# EAGLE design keyswitch (EAGLE 8.1.1)
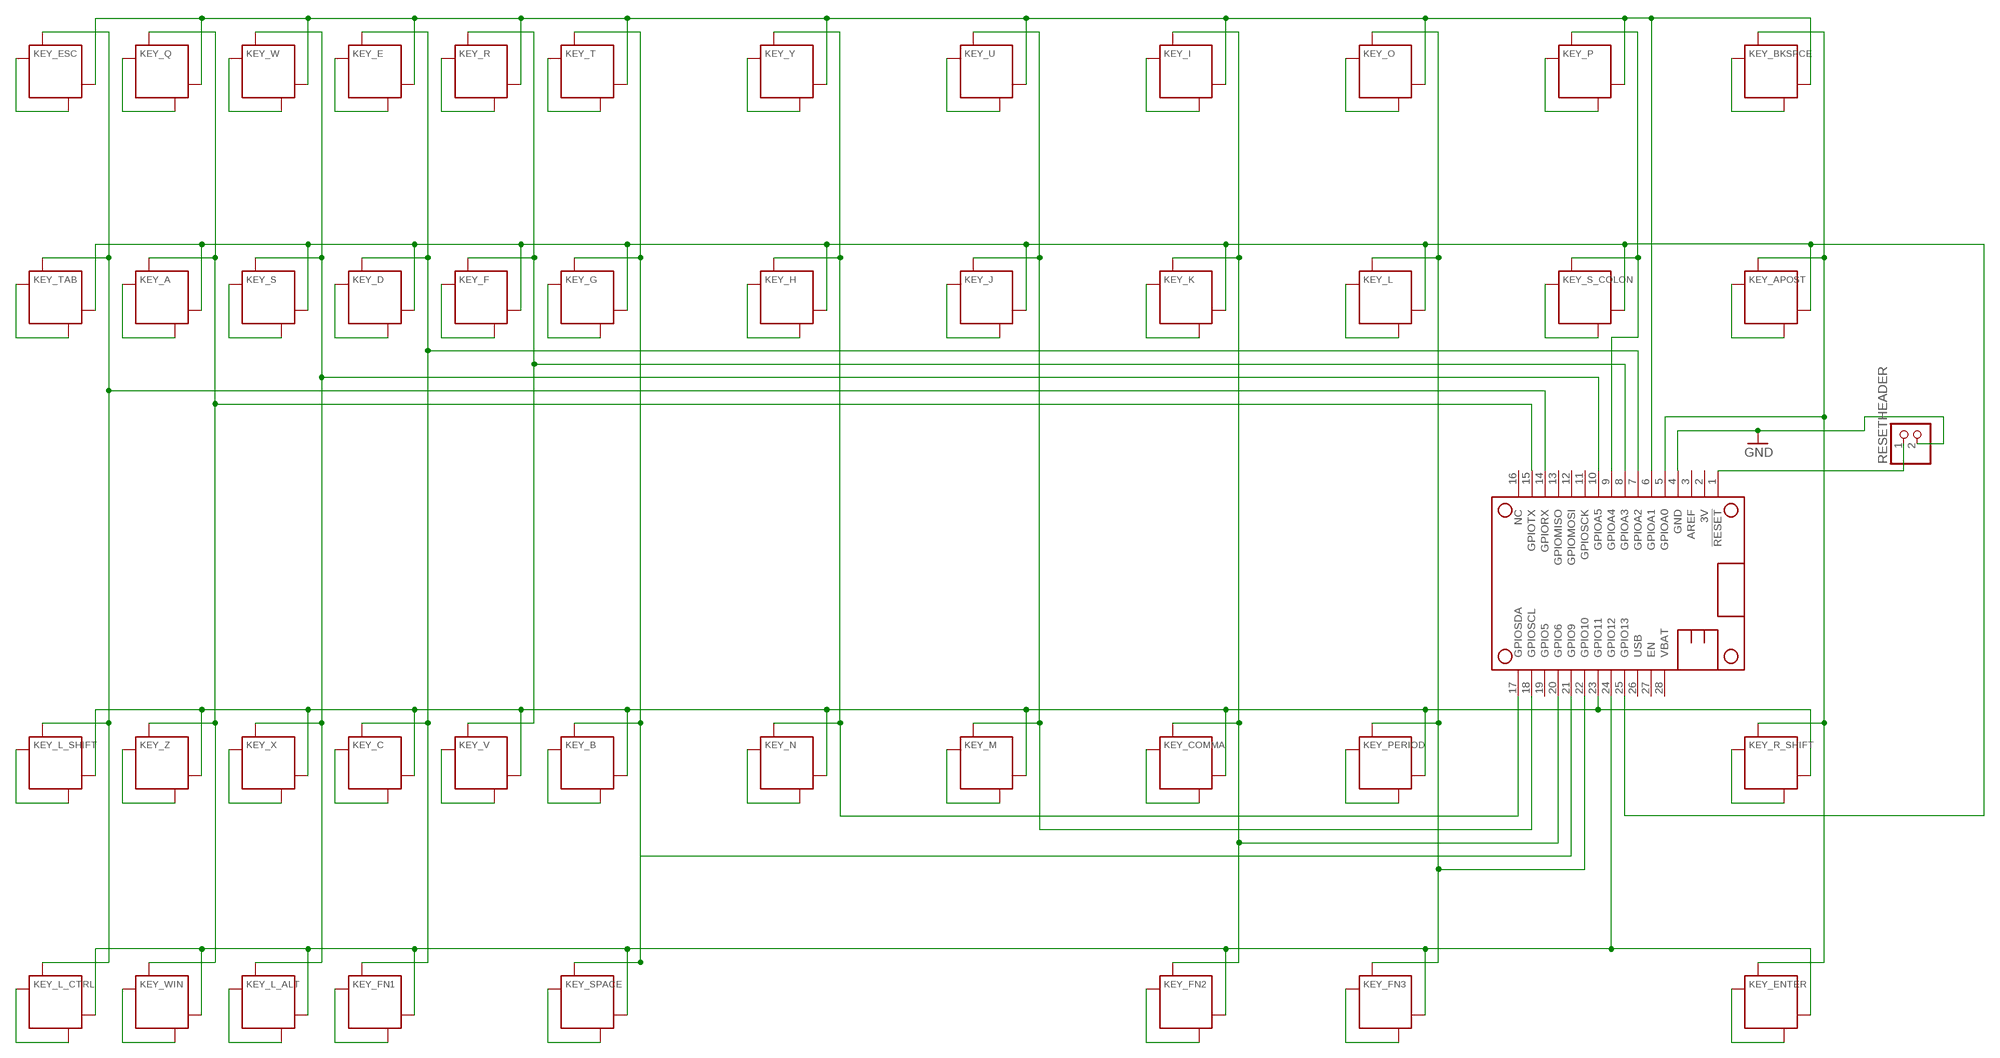
[diagram p0: schematic, sheet 1]

## Parts
FEATHER  FEATHERWING_NODIM  [FEATHERWING_DIM]
KEY_A  KEYSWITCH-DIODE-MX-1U-DIODE  [MX-1U-DIODE]
KEY_APOST  KEYSWITCH-DIODE-MX-1U-DIODE  [MX-1U-DIODE]
KEY_B  KEYSWITCH-DIODE-MX-1U-DIODE  [MX-1U-DIODE]
KEY_BKSPCE  KEYSWITCH-DIODE-MX-1U-DIODE  [MX-1U-DIODE]
KEY_C  KEYSWITCH-DIODE-MX-1U-DIODE  [MX-1U-DIODE]
KEY_COMMA  KEYSWITCH-DIODE-MX-1U-DIODE  [MX-1U-DIODE]
KEY_D  KEYSWITCH-DIODE-MX-1U-DIODE  [MX-1U-DIODE]
KEY_E  KEYSWITCH-DIODE-MX-1U-DIODE  [MX-1U-DIODE]
KEY_ENTER  KEYSWITCH-DIODE-MX-1U-DIODE  [MX-1U-DIODE]
KEY_ESC  KEYSWITCH-DIODE-MX-1U-DIODE  [MX-1U-DIODE]
KEY_F  KEYSWITCH-DIODE-MX-1U-DIODE  [MX-1U-DIODE]
KEY_FN1  KEYSWITCH-DIODE-MX-1U-DIODE  [MX-1U-DIODE]
KEY_FN2  KEYSWITCH-DIODE-MX-1U-DIODE  [MX-1U-DIODE]
KEY_FN3  KEYSWITCH-DIODE-MX-1U-DIODE  [MX-1U-DIODE]
KEY_G  KEYSWITCH-DIODE-MX-1U-DIODE  [MX-1U-DIODE]
KEY_H  KEYSWITCH-DIODE-MX-1U-DIODE  [MX-1U-DIODE]
KEY_I  KEYSWITCH-DIODE-MX-1U-DIODE  [MX-1U-DIODE]
KEY_J  KEYSWITCH-DIODE-MX-1U-DIODE  [MX-1U-DIODE]
KEY_K  KEYSWITCH-DIODE-MX-1U-DIODE  [MX-1U-DIODE]
KEY_L  KEYSWITCH-DIODE-MX-1U-DIODE  [MX-1U-DIODE]
KEY_L_ALT  KEYSWITCH-DIODE-MX-1U-DIODE  [MX-1U-DIODE]
KEY_L_CTRL  KEYSWITCH-DIODE-MX-1U-DIODE  [MX-1U-DIODE]
KEY_L_SHIFT  KEYSWITCH-DIODE-MX-1U-DIODE  [MX-1U-DIODE]
KEY_M  KEYSWITCH-DIODE-MX-1U-DIODE  [MX-1U-DIODE]
KEY_N  KEYSWITCH-DIODE-MX-1U-DIODE  [MX-1U-DIODE]
KEY_O  KEYSWITCH-DIODE-MX-1U-DIODE  [MX-1U-DIODE]
KEY_P  KEYSWITCH-DIODE-MX-1U-DIODE  [MX-1U-DIODE]
KEY_PERIOD  KEYSWITCH-DIODE-MX-1U-DIODE  [MX-1U-DIODE]
KEY_Q  KEYSWITCH-DIODE-MX-1U-DIODE  [MX-1U-DIODE]
KEY_R  KEYSWITCH-DIODE-MX-1U-DIODE  [MX-1U-DIODE]
KEY_R_SHIFT  KEYSWITCH-DIODE-MX-1U-DIODE  [MX-1U-DIODE]
KEY_S  KEYSWITCH-DIODE-MX-1U-DIODE  [MX-1U-DIODE]
KEY_S_COLON  KEYSWITCH-DIODE-MX-1U-DIODE  [MX-1U-DIODE]
KEY_SPACE  KEYSWITCH-DIODE-MX-1U-DIODE  [MX-1U-DIODE]
KEY_T  KEYSWITCH-DIODE-MX-1U-DIODE  [MX-1U-DIODE]
KEY_TAB  KEYSWITCH-DIODE-MX-1U-DIODE  [MX-1U-DIODE]
KEY_U  KEYSWITCH-DIODE-MX-1U-DIODE  [MX-1U-DIODE]
KEY_V  KEYSWITCH-DIODE-MX-1U-DIODE  [MX-1U-DIODE]
KEY_W  KEYSWITCH-DIODE-MX-1U-DIODE  [MX-1U-DIODE]
KEY_WIN  KEYSWITCH-DIODE-MX-1U-DIODE  [MX-1U-DIODE]
KEY_X  KEYSWITCH-DIODE-MX-1U-DIODE  [MX-1U-DIODE]
KEY_Y  KEYSWITCH-DIODE-MX-1U-DIODE  [MX-1U-DIODE]
KEY_Z  KEYSWITCH-DIODE-MX-1U-DIODE  [MX-1U-DIODE]
RESETHEADER  PINHD-1X2  [1X02]

## Nets
GND: FEATHER.4(GND) RESETHEADER.2
N$1: KEY_ESC.D+ KEY_ESC.MX1(P0)
N$2: KEY_Q.D+ KEY_Q.MX1(P0)
N$3: KEY_W.D+ KEY_W.MX1(P0)
N$4: KEY_E.D+ KEY_E.MX1(P0)
N$5: KEY_R.D+ KEY_R.MX1(P0)
N$6: KEY_T.D+ KEY_T.MX1(P0)
N$7: KEY_Y.D+ KEY_Y.MX1(P0)
N$8: KEY_U.D+ KEY_U.MX1(P0)
N$9: KEY_I.D+ KEY_I.MX1(P0)
N$10: KEY_O.D+ KEY_O.MX1(P0)
N$11: KEY_P.D+ KEY_P.MX1(P0)
N$12: KEY_BKSPCE.D+ KEY_BKSPCE.MX1(P0)
N$13: KEY_TAB.D+ KEY_TAB.MX1(P0)
N$14: KEY_A.D+ KEY_A.MX1(P0)
N$15: KEY_S.D+ KEY_S.MX1(P0)
N$16: KEY_D.D+ KEY_D.MX1(P0)
N$17: KEY_F.D+ KEY_F.MX1(P0)
N$18: KEY_G.D+ KEY_G.MX1(P0)
N$19: KEY_H.D+ KEY_H.MX1(P0)
N$20: KEY_J.D+ KEY_J.MX1(P0)
N$21: KEY_K.D+ KEY_K.MX1(P0)
N$22: KEY_L.D+ KEY_L.MX1(P0)
N$23: KEY_S_COLON.D+ KEY_S_COLON.MX1(P0)
N$24: KEY_APOST.D+ KEY_APOST.MX1(P0)
N$25: KEY_L_SHIFT.D+ KEY_L_SHIFT.MX1(P0)
N$26: KEY_Z.D+ KEY_Z.MX1(P0)
N$27: KEY_X.D+ KEY_X.MX1(P0)
N$28: KEY_C.D+ KEY_C.MX1(P0)
N$29: KEY_V.D+ KEY_V.MX1(P0)
N$30: KEY_B.D+ KEY_B.MX1(P0)
N$31: KEY_N.D+ KEY_N.MX1(P0)
N$32: KEY_M.D+ KEY_M.MX1(P0)
N$33: KEY_COMMA.D+ KEY_COMMA.MX1(P0)
N$34: KEY_PERIOD.D+ KEY_PERIOD.MX1(P0)
N$35: FEATHER.7(GPIOA2) KEY_C.MX2(P1) KEY_D.MX2(P1) KEY_E.MX2(P1) KEY_FN1.MX2(P1)
N$36: KEY_R_SHIFT.D+ KEY_R_SHIFT.MX1(P0)
N$37: KEY_WIN.D+ KEY_WIN.MX1(P0)
N$38: KEY_L_ALT.D+ KEY_L_ALT.MX1(P0)
N$39: KEY_FN1.D+ KEY_FN1.MX1(P0)
N$40: FEATHER.1(!RESET) RESETHEADER.1
N$41: KEY_SPACE.D+ KEY_SPACE.MX1(P0)
N$42: FEATHER.15(GPIOTX) KEY_A.MX2(P1) KEY_Q.MX2(P1) KEY_WIN.MX2(P1) KEY_Z.MX2(P1)
N$43: FEATHER.10(GPIOA5) KEY_L_ALT.MX2(P1) KEY_S.MX2(P1) KEY_W.MX2(P1) KEY_X.MX2(P1)
N$44: KEY_FN2.D+ KEY_FN2.MX1(P0)
N$45: KEY_FN3.D+ KEY_FN3.MX1(P0)
N$46: FEATHER.21(GPIO9) KEY_B.MX2(P1) KEY_G.MX2(P1) KEY_SPACE.MX2(P1) KEY_T.MX2(P1)
N$47: KEY_ENTER.D+ KEY_ENTER.MX1(P0)
N$49: FEATHER.8(GPIOA3) KEY_F.MX2(P1) KEY_R.MX2(P1) KEY_V.MX2(P1)
N$50: FEATHER.24(GPIO12) KEY_ENTER.D- KEY_FN1.D- KEY_FN2.D- KEY_FN3.D- KEY_L_ALT.D- KEY_L_CTRL.D- KEY_SPACE.D- KEY_WIN.D-
N$51: FEATHER.17(GPIOSDA) KEY_H.MX2(P1) KEY_N.MX2(P1) KEY_Y.MX2(P1)
N$52: FEATHER.22(GPIO10) KEY_FN3.MX2(P1) KEY_L.MX2(P1) KEY_O.MX2(P1) KEY_PERIOD.MX2(P1)
N$53: FEATHER.20(GPIO6) KEY_COMMA.MX2(P1) KEY_FN2.MX2(P1) KEY_I.MX2(P1) KEY_K.MX2(P1)
N$54: FEATHER.18(GPIOSCL) KEY_J.MX2(P1) KEY_M.MX2(P1) KEY_U.MX2(P1)
N$55: FEATHER.9(GPIOA4) KEY_P.MX2(P1) KEY_S_COLON.MX2(P1)
N$56: FEATHER.5(GPIOA0) KEY_APOST.MX2(P1) KEY_BKSPCE.MX2(P1) KEY_ENTER.MX2(P1) KEY_R_SHIFT.MX2(P1)
N$57: FEATHER.6(GPIOA1) KEY_BKSPCE.D- KEY_E.D- KEY_ESC.D- KEY_I.D- KEY_O.D- KEY_P.D- KEY_Q.D- KEY_R.D- KEY_T.D- KEY_U.D- KEY_W.D- KEY_Y.D-
N$58: FEATHER.14(GPIORX) KEY_ESC.MX2(P1) KEY_L_CTRL.MX2(P1) KEY_L_SHIFT.MX2(P1) KEY_TAB.MX2(P1)
N$59: FEATHER.23(GPIO11) KEY_B.D- KEY_C.D- KEY_COMMA.D- KEY_L_SHIFT.D- KEY_M.D- KEY_N.D- KEY_PERIOD.D- KEY_R_SHIFT.D- KEY_V.D- KEY_X.D- KEY_Z.D-
N$60: KEY_L_CTRL.D+ KEY_L_CTRL.MX1(P0)
N$72: FEATHER.25(GPIO13) KEY_A.D- KEY_APOST.D- KEY_D.D- KEY_F.D- KEY_G.D- KEY_H.D- KEY_J.D- KEY_K.D- KEY_L.D- KEY_S.D- KEY_S_COLON.D- KEY_TAB.D-
Unconnected: FEATHER.2(3V) FEATHER.3(AREF) FEATHER.11(GPIOSCK) FEATHER.12(GPIOMOSI) FEATHER.13(GPIOMISO) FEATHER.16(NC) FEATHER.19(GPIO5) FEATHER.26(USB) FEATHER.27(EN) FEATHER.28(VBAT)

## Library data of the parts
FEATHER = adafruit:FEATHERWING
KEY_A KEY_APOST KEY_B KEY_BKSPCE KEY_C KEY_COMMA KEY_D KEY_E KEY_ENTER KEY_ESC KEY_F KEY_FN1-KEY_FN3 KEY_G KEY_H KEY_I KEY_J KEY_K KEY_L KEY_L_ALT KEY_L_CTRL KEY_L_SHIFT KEY_M KEY_N KEY_O KEY_P KEY_PERIOD KEY_Q KEY_R KEY_R_SHIFT KEY_S KEY_S_COLON KEY_SPACE KEY_T KEY_TAB KEY_U KEY_V KEY_W KEY_WIN KEY_X KEY_Y KEY_Z = Keyboard:KEYSWITCH-DIODE
RESETHEADER = pinhead:PINHD-1X2: PIN HEADER

## Net classes
0 default: clearance 0.205 mm

## Board
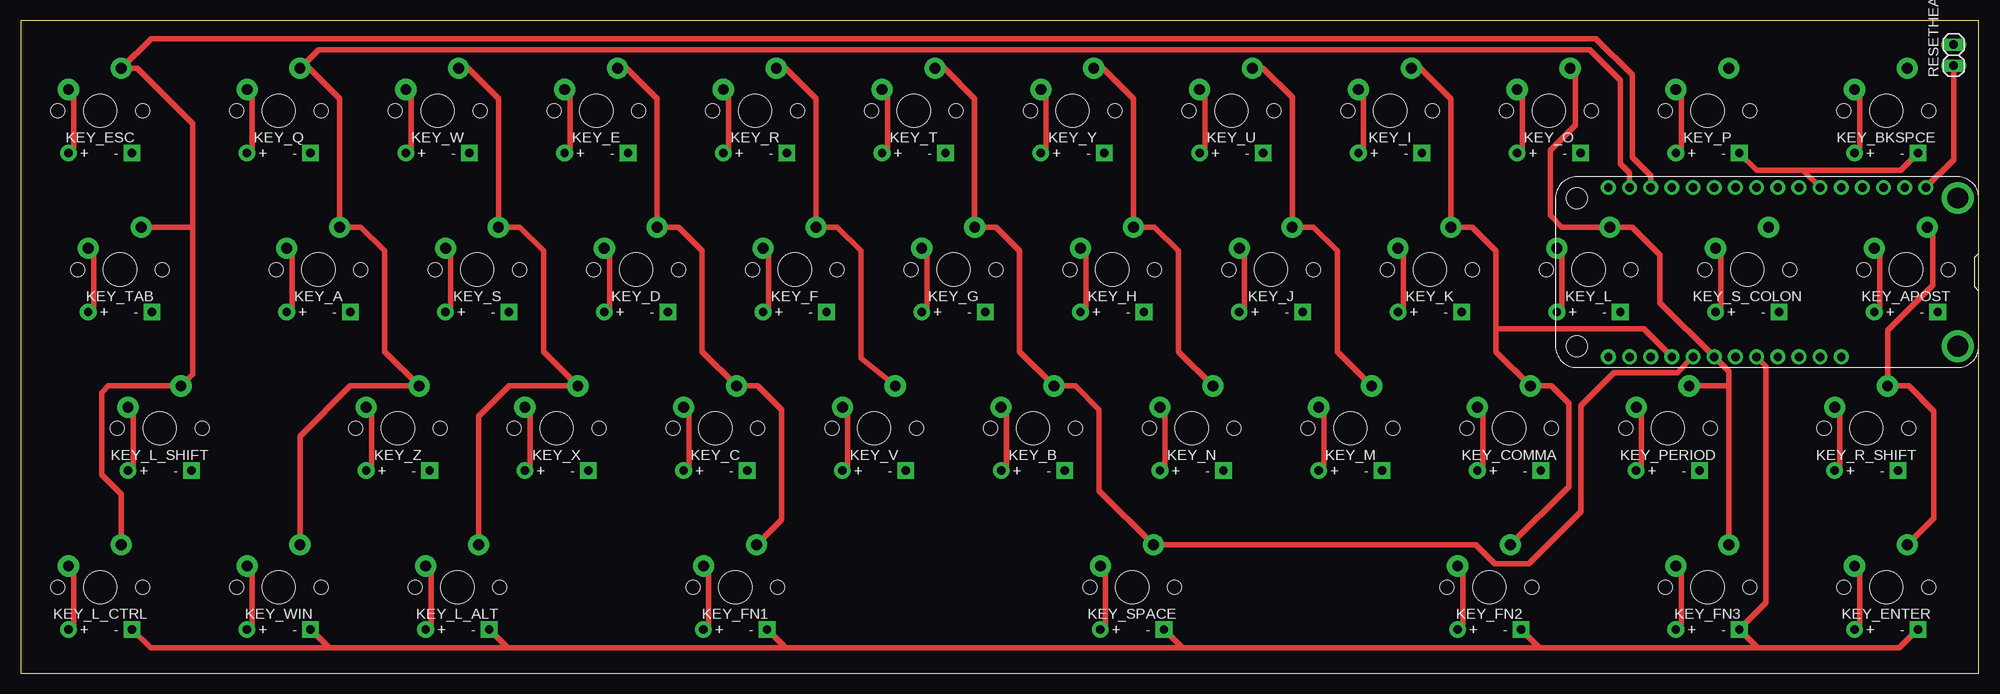
[diagram p1: board, top side]
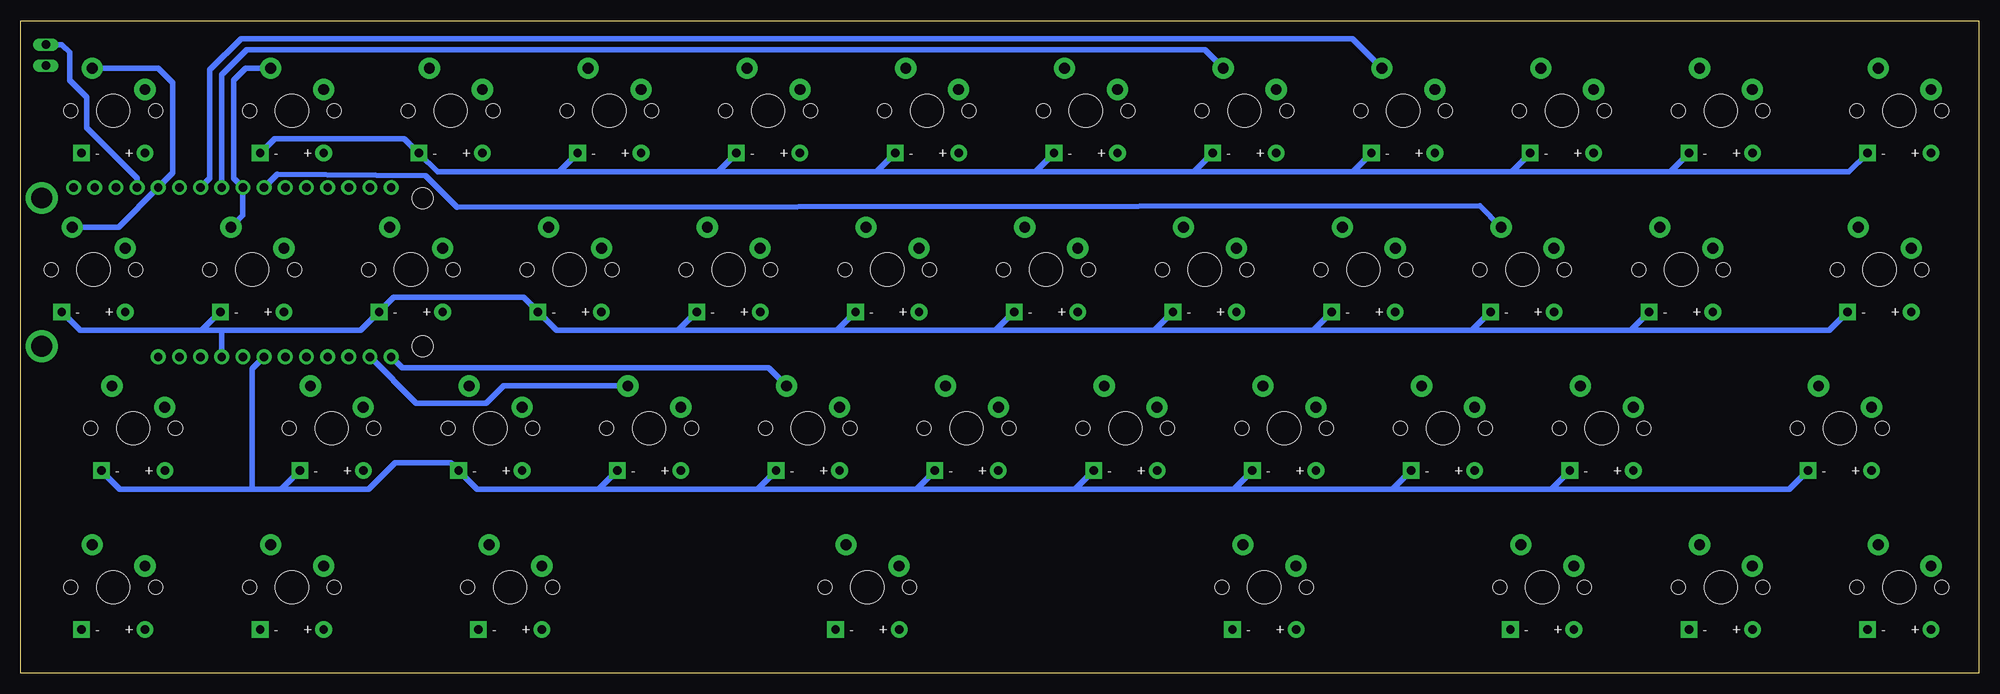
[diagram p2: board, bottom side, seen from below]

Size 234.93 x 78.25 mm. Coordinates in mm from the lower left corner, seen from the top.
Outline: 0,0 234.93,0 234.93,78.25 0,78.25 0,0
Copper layers (1*16): Top 0.035mm / dielectric 1.5mm / Bottom 0.035mm
Design rules "keyswitch *": minimum track width 10mil, minimum drill 20mil, track to track 10mil, track to pad 10mil, pad to pad 10mil, via to via 10mil, smd to smd 10mil, copper to edge 20mil, drill to drill 8mil, minimum pad ring 10mil, minimum via ring 8mil, stop-mask expansion 4mil, vias tented up to drill 0mil, thermal gap 10mil

### Footprints (pad centres in the part's own frame; a part is rotated, then mirrored left to right if it is on the bottom)
FEATHERWING_DIM = drill 1 pad 1.778: 1 6.35,1.27; 2 8.89,1.27; 3 11.43,1.27; 4 13.97,1.27; 5 16.51,1.27; 6 19.05,1.27; 7 21.59,1.27; 8 24.13,1.27; 9 26.67,1.27; 10 29.21,1.27; 11 31.75,1.27; 12 34.29,1.27; 13 36.83,1.27; 14 39.37,1.27; 15 41.91,1.27; 16 44.45,1.27; 17 44.45,21.59; 18 41.91,21.59; 19 39.37,21.59; 20 36.83,21.59; 21 34.29,21.59; 22 31.75,21.59; 23 29.21,21.59; 24 26.67,21.59; 25 24.13,21.59; 26 21.59,21.59; 27 19.05,21.59; 28 16.51,21.59 | drill 2.5 pad 3.81: P$1 2.54,20.32; P$2 2.54,2.54 | hole 2.54: 48.26,20.32; 48.26,2.54
MX-1U-DIODE = drill 1 pad 2: D+ -3.81,-5.08 | drill 1 pad 2 square: D- 3.81,-5.08 | drill 1.3 pad 2.54: MX1 -3.81,2.54; MX2 2.54,5.08 | hole 4: 0,0 | hole 1.7: -5.08,0; 5.08,0
1X02 = drill 1.016 long: 1 -1.27,0; 2 1.27,0

### Placement (x,y rotation side)
FEATHER  234.95,59.53 180 top
KEY_A  35.72,48.42 0 top
KEY_APOST  226.22,48.42 0 top
KEY_B  121.44,29.37 0 top
KEY_BKSPCE  223.84,67.47 0 top
KEY_C  83.34,29.37 0 top
KEY_COMMA  178.59,29.37 0 top
KEY_D  73.82,48.42 0 top
KEY_E  69.06,67.47 0 top
KEY_ENTER  223.84,10.32 0 top
KEY_ESC  9.53,67.47 0 top
KEY_F  92.87,48.42 0 top
KEY_FN1  85.73,10.32 0 top
KEY_FN2  176.21,10.32 0 top
KEY_FN3  202.41,10.32 0 top
KEY_G  111.92,48.42 0 top
KEY_H  130.97,48.42 0 top
KEY_I  164.31,67.47 0 top
KEY_J  150.02,48.42 0 top
KEY_K  169.07,48.42 0 top
KEY_L  188.12,48.42 0 top
KEY_L_ALT  52.39,10.32 0 top
KEY_L_CTRL  9.53,10.32 0 top
KEY_L_SHIFT  16.67,29.37 0 top
KEY_M  159.54,29.37 0 top
KEY_N  140.49,29.37 0 top
KEY_O  183.36,67.47 0 top
KEY_P  202.41,67.47 0 top
KEY_PERIOD  197.64,29.37 0 top
KEY_Q  30.96,67.47 0 top
KEY_R  88.11,67.47 0 top
KEY_R_SHIFT  221.46,29.37 0 top
KEY_S  54.77,48.42 0 top
KEY_S_COLON  207.17,48.42 0 top
KEY_SPACE  133.35,10.32 0 top
KEY_T  107.16,67.47 0 top
KEY_TAB  11.91,48.42 0 top
KEY_U  145.26,67.47 0 top
KEY_V  102.39,29.37 0 top
KEY_W  50.01,67.47 0 top
KEY_WIN  30.96,10.32 0 top
KEY_X  64.29,29.37 0 top
KEY_Y  126.21,67.47 0 top
KEY_Z  45.24,29.37 0 top
RESETHEADER  231.93,74.14 90 top

### Tracks (layer width: path | path; a pad name or v marks a point on that pad's centre or on a via)
GND
  Bottom 0.635: FEATHER.4 220.98,59.37 227.01,65.4 227.01,69.06 229.08,71.12 229.08,74.45 230.03,75.41 RESETHEADER.2
N$1
  Top 0.635: KEY_ESC.MX1 6.35,69.37 6.35,63.02 KEY_ESC.D+
N$2
  Top 0.635: KEY_Q.MX1 27.78,69.37 27.78,63.02 KEY_Q.D+
N$3
  Top 0.635: KEY_W.MX1 46.83,69.37 46.83,63.02 KEY_W.D+
N$4
  Top 0.635: KEY_E.MX1 65.88,69.37 65.88,63.02 KEY_E.D+
N$5
  Top 0.635: KEY_R.MX1 84.93,69.37 84.93,63.02 KEY_R.D+
N$6
  Top 0.635: KEY_T.MX1 103.98,69.37 103.98,63.02 KEY_T.D+
N$7
  Top 0.635: KEY_Y.MX1 123.03,69.37 123.03,63.02 KEY_Y.D+
N$8
  Top 0.635: KEY_U.MX1 142.08,69.37 142.08,63.02 KEY_U.D+
N$9
  Top 0.635: KEY_I.MX1 161.13,69.37 161.13,63.02 KEY_I.D+
N$10
  Top 0.635: KEY_O.MX1 180.18,69.37 180.18,63.02 KEY_O.D+
N$11
  Top 0.635: KEY_P.MX1 199.23,69.37 199.23,63.02 KEY_P.D+
N$12
  Top 0.635: KEY_BKSPCE.MX1 220.66,69.37 220.66,63.02 KEY_BKSPCE.D+
N$13
  Top 0.635: KEY_TAB.MX1 8.73,50.32 8.73,43.97 KEY_TAB.D+
N$14
  Top 0.635: KEY_A.MX1 32.54,50.32 32.54,43.97 KEY_A.D+
N$15
  Top 0.635: KEY_S.MX1 51.59,50.32 51.59,43.97 KEY_S.D+
N$16
  Top 0.635: KEY_D.MX1 70.64,50.32 70.64,43.97 KEY_D.D+
N$17
  Top 0.635: KEY_F.MX1 89.69,50.32 89.69,43.97 KEY_F.D+
N$18
  Top 0.635: KEY_G.MX1 108.74,50.32 108.74,43.97 KEY_G.D+
N$19
  Top 0.635: KEY_H.MX1 127.79,50.32 127.79,43.97 KEY_H.D+
N$20
  Top 0.635: KEY_J.MX1 146.84,50.32 146.84,43.97 KEY_J.D+
N$21
  Top 0.635: KEY_K.MX1 165.89,50.32 165.89,43.97 KEY_K.D+
N$22
  Top 0.635: KEY_L.MX1 184.94,50.32 184.94,43.97 KEY_L.D+
N$23
  Top 0.635: KEY_S_COLON.MX1 203.99,50.32 203.99,43.97 KEY_S_COLON.D+
N$24
  Top 0.635: KEY_APOST.MX1 223.04,50.32 223.04,43.97 KEY_APOST.D+
N$25
  Top 0.635: KEY_L_SHIFT.MX1 13.49,31.27 13.49,24.92 KEY_L_SHIFT.D+
N$26
  Top 0.635: KEY_Z.MX1 42.07,31.27 42.07,24.92 KEY_Z.D+
N$27
  Top 0.635: KEY_X.MX1 61.12,31.27 61.12,24.92 KEY_X.D+
N$28
  Top 0.635: KEY_C.MX1 80.17,31.27 80.17,24.92 KEY_C.D+
N$29
  Top 0.635: KEY_V.MX1 99.22,31.27 99.22,24.92 KEY_V.D+
N$30
  Top 0.635: KEY_B.MX1 118.27,31.27 118.27,24.92 KEY_B.D+
N$31
  Top 0.635: KEY_N.MX1 137.32,31.27 137.32,24.92 KEY_N.D+
N$32
  Top 0.635: KEY_M.MX1 156.37,31.27 156.37,24.92 KEY_M.D+
N$33
  Top 0.635: KEY_COMMA.MX1 175.42,31.27 175.42,24.92 KEY_COMMA.D+
N$34
  Top 0.635: KEY_PERIOD.MX1 194.47,31.27 194.47,24.92 KEY_PERIOD.D+
N$35
  Top 0.635: KEY_E.MX2 72.71,72.55 76.36,68.9 KEY_D.MX2 78.9,53.5 81.76,50.64 81.76,38.58 KEY_C.MX2 88.42,34.45 91.28,31.59 91.28,18.41 KEY_FN1.MX2
  Bottom 0.635: KEY_E.MX2 75.17,76.12 208.52,76.12 212.25,72.39 212.25,59.37 FEATHER.7
N$36
  Top 0.635: KEY_R_SHIFT.MX1 218.28,31.27 218.28,24.92 KEY_R_SHIFT.D+
N$37
  Top 0.635: KEY_WIN.MX1 27.78,12.22 27.78,5.87 KEY_WIN.D+
N$38
  Top 0.635: KEY_L_ALT.MX1 49.21,12.22 49.21,5.87 KEY_L_ALT.D+
N$39
  Top 0.635: KEY_FN1.MX1 82.55,12.22 82.55,5.87 KEY_FN1.D+
N$40
  Top 0.635: FEATHER.1 231.93,61.59 RESETHEADER.1
N$41
  Top 0.635: KEY_SPACE.MX1 130.18,12.22 130.18,5.87 KEY_SPACE.D+
N$42
  Top 0.635: KEY_WIN.MX2 33.5,28.42 39.53,34.45 KEY_Z.MX2 43.66,38.58 43.66,50.64 40.8,53.5 KEY_A.MX2 38.26,68.9 34.61,72.55 KEY_Q.MX2 35.72,74.77 188.28,74.77 191.93,71.12 191.93,61.12 193.04,60.01 FEATHER.15
N$43
  Top 0.635: KEY_W.MX2 53.66,72.55 57.31,68.9 KEY_S.MX2 59.85,53.5 62.71,50.64 62.71,38.58 KEY_X.MX2 58.58,34.45 54.93,30.8 KEY_L_ALT.MX2
  Bottom 0.635: FEATHER.10 204.15,59.85 186.37,59.69 182.56,55.88 59.85,56.04 KEY_S.MX2
N$44
  Top 0.635: KEY_FN2.MX1 173.04,12.22 173.04,5.87 KEY_FN2.D+
N$45
  Top 0.635: KEY_FN3.MX1 199.23,12.22 199.23,5.87 KEY_FN3.D+
N$46
  Top 0.635: KEY_T.MX2 110.81,72.55 114.46,68.9 KEY_G.MX2 117,53.5 119.86,50.64 119.86,38.58 KEY_B.MX2 126.52,34.45 129.38,31.59 129.38,21.91 KEY_SPACE.MX2 174.62,15.4 176.88,13.14 180.94,13.14 187.17,19.37 187.17,32.07 191.14,36.04 198.75,36.04 FEATHER.21
N$47
  Top 0.635: KEY_ENTER.MX1 220.66,12.22 220.66,5.87 KEY_ENTER.D+
N$49
  Top 0.635: KEY_R.MX2 91.76,72.55 95.41,68.9 KEY_F.MX2 97.95,53.5 100.81,50.64 100.81,37.78 KEY_V.MX2
  Bottom 0.635: KEY_R.MX2 92.87,74.77 207.8,74.77 210.82,71.75 FEATHER.8
N$50
  Top 0.635: KEY_L_CTRL.D- 15.56,3.02 36.99,3.02 | 36.99,3.02 KEY_WIN.D- | 36.99,3.02 58.42,3.02 | 58.42,3.02 KEY_L_ALT.D- | 58.42,3.02 91.76,3.02 | KEY_FN1.D- 91.76,3.02 | 91.76,3.02 139.38,3.02 | KEY_SPACE.D- 139.38,3.02 | 139.38,3.02 182.25,3.02 | 182.25,3.02 KEY_FN2.D- | 182.25,3.02 208.44,3.02 | 208.44,3.02 KEY_FN3.D- 209.39,8.41 209.39,36.83 FEATHER.24 | KEY_ENTER.D- 225.43,3.02 208.44,3.02
N$51
  Top 0.635: KEY_Y.MX2 129.86,72.55 133.51,68.9 KEY_H.MX2 136.05,53.5 138.91,50.64 138.91,38.58 KEY_N.MX2
  Bottom 0.635: KEY_N.MX2 145.19,36.61 189.17,36.61 FEATHER.17
N$52
  Top 0.635: KEY_O.MX2 186.53,71.91 186.53,65.72 183.52,62.71 183.52,54.93 184.94,53.5 KEY_L.MX2 193.36,53.5 196.69,50.16 196.69,44.45 FEATHER.22 204.95,36.19 204.95,34.29 | 204.95,34.29 KEY_FN3.MX2 | KEY_PERIOD.MX2 204.95,34.45 204.95,34.29
N$53
  Top 0.635: KEY_I.MX2 167.96,72.55 171.61,68.9 KEY_K.MX2 174.15,53.5 177.01,50.64 177.01,41.31 | 177.01,41.31 177.01,38.58 KEY_COMMA.MX2 183.67,34.45 185.74,32.38 185.74,22.38 KEY_FN2.MX2 | 177.01,41.31 194.75,41.31 FEATHER.20
N$54
  Top 0.635: KEY_U.MX2 149.07,72.55 152.56,69.06 KEY_J.MX2 155.1,53.5 157.96,50.64 157.96,38.58 KEY_M.MX2
  Bottom 0.635: KEY_M.MX2 177.01,34.45 179.07,32.38 187.48,32.38 FEATHER.18
N$55
  Bottom 0.635: KEY_P.MX2 207.96,72.55 209.39,71.12 209.39,59.37 FEATHER.9 208.28,54.93 KEY_S_COLON.MX2
N$56
  Top 0.635: KEY_ENTER.MX2 229.55,18.57 229.55,31.43 226.54,34.45 KEY_R_SHIFT.MX2 224,41.12 229.39,46.51 229.39,52.86 KEY_APOST.MX2
  Bottom 0.635: KEY_APOST.MX2 223.2,53.5 FEATHER.5 216.69,60.01 216.69,70.8 218.44,72.55 KEY_BKSPCE.MX2
N$57
  Top 0.635: KEY_P.D- 208.28,60.32 213.84,60.32 | 213.84,60.32 225.58,60.32 KEY_BKSPCE.D- | FEATHER.6 213.84,60.32
  Bottom 0.635: KEY_ESC.D- 15.56,60.17 36.99,60.17 | 36.99,60.17 KEY_Q.D- | 36.99,60.17 56.04,60.17 | KEY_W.D- 56.04,60.17 | 56.04,60.17 75.09,60.17 | 75.09,60.17 KEY_E.D- | 75.09,60.17 94.14,60.17 | 94.14,60.17 KEY_R.D- | 94.14,60.17 113.19,60.17 | 113.19,60.17 KEY_T.D- | 113.19,60.17 132.24,60.17 | 132.24,60.17 KEY_Y.D- | 132.24,60.17 151.29,60.17 | KEY_U.D- 151.29,60.17 | 151.29,60.17 170.34,60.17 | KEY_I.D- 170.34,60.17 | 170.34,60.17 184.94,60.17 KEY_O.D- 188.91,64.14 204.47,64.14 KEY_P.D-
N$58
  Top 0.635: KEY_L_CTRL.MX2 12.07,21.43 9.68,23.81 9.68,33.65 10.48,34.45 KEY_L_SHIFT.MX2 20.64,35.88 20.64,53.5 | 20.64,53.5 20.64,65.88 13.97,72.55 KEY_ESC.MX2 15.64,76.12 188.99,76.12 193.36,71.75 193.36,61.91 195.58,59.69 FEATHER.14 | KEY_TAB.MX2 20.64,53.5
N$59
  Bottom 0.635: KEY_L_SHIFT.D- 22.7,22.07 51.28,22.07 | 51.28,22.07 KEY_Z.D- | 51.28,22.07 70.33,22.07 | KEY_X.D- 70.33,22.07 | 70.33,22.07 89.38,22.07 | KEY_C.D- 89.38,22.07 | 89.38,22.07 108.43,22.07 | 108.43,22.07 KEY_V.D- | 108.43,22.07 127.48,22.07 | KEY_B.D- 127.48,22.07 | 127.48,22.07 146.53,22.07 | 146.53,22.07 KEY_N.D- | 146.53,22.07 165.58,22.07 | KEY_M.D- 165.58,22.07 | 165.58,22.07 180.18,22.07 KEY_COMMA.D- 183.36,25.24 190.02,25.24 193.2,22.07 203.68,22.07 | KEY_PERIOD.D- 203.68,22.07 | KEY_R_SHIFT.D- 223.04,22.07 207.17,22.07 | 207.17,22.07 203.68,22.07 | FEATHER.23 207.17,36.51 207.17,22.07
N$60
  Top 0.635: KEY_L_CTRL.MX1 6.35,12.22 6.35,5.87 KEY_L_CTRL.D+
N$72
  Bottom 0.635: KEY_TAB.D- 17.94,41.12 41.75,41.12 | KEY_A.D- 41.75,41.12 | 41.75,41.12 60.8,41.12 | 60.8,41.12 KEY_S.D- | 60.8,41.12 79.85,41.12 | KEY_D.D- 79.85,41.12 | 79.85,41.12 98.9,41.12 | KEY_F.D- 98.9,41.12 | 98.9,41.12 117.95,41.12 | KEY_G.D- 117.95,41.12 | 117.95,41.12 137,41.12 | 137,41.12 KEY_H.D- | 137,41.12 156.05,41.12 | KEY_J.D- 156.05,41.12 | 156.05,41.12 170.66,41.12 KEY_K.D- 174.62,45.08 190.18,45.08 KEY_L.D- 194.15,41.12 210.82,41.12 | 210.82,41.12 213.2,41.12 | KEY_S_COLON.D- 213.2,41.12 | KEY_APOST.D- 227.81,41.12 213.2,41.12 | FEATHER.25 210.82,41.12